# EAGLE schematic snc98_6mm_plate_V-Cut (EAGLE 6.6.0)
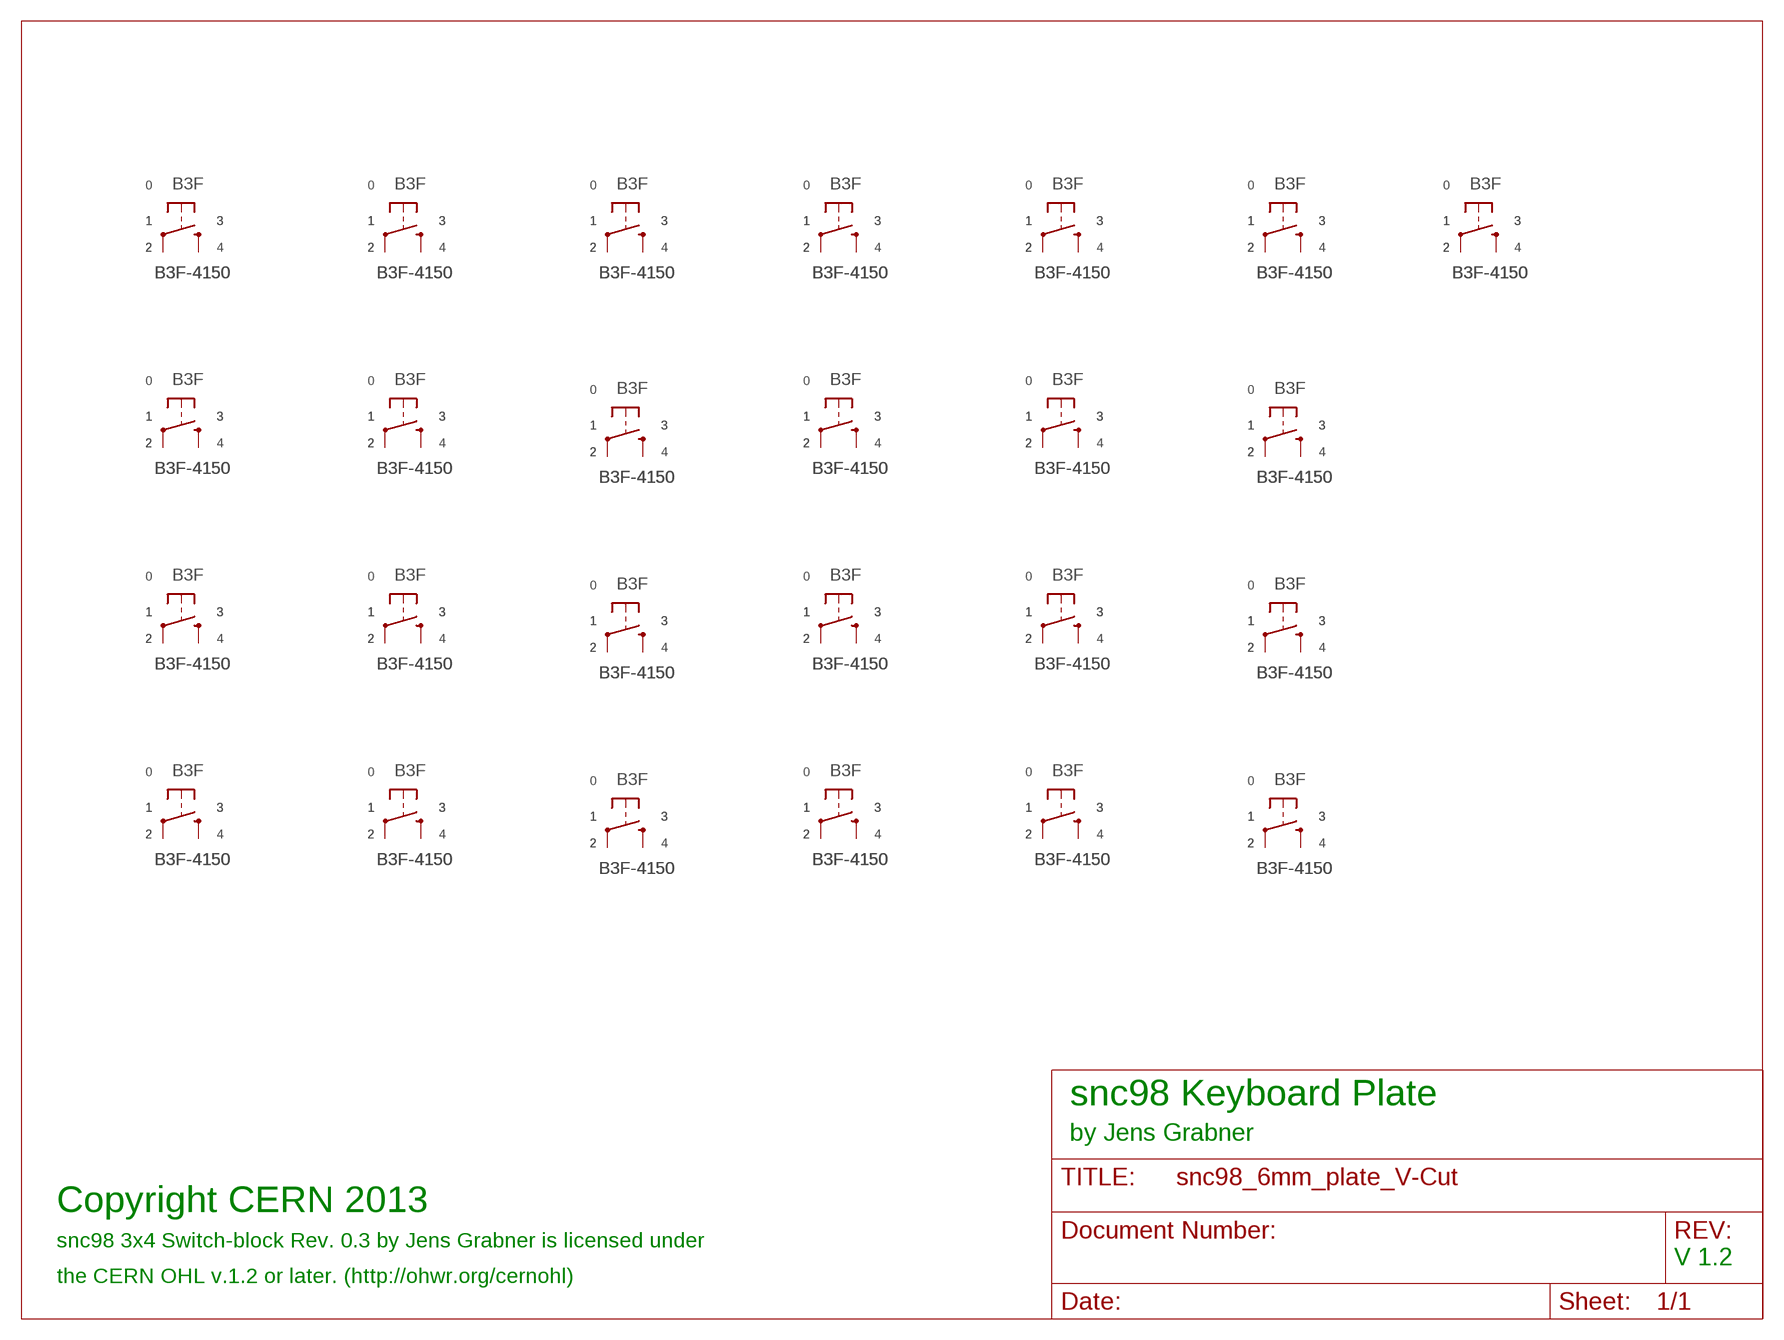
[diagram p0: schematic, sheet 1]

## Parts
S1  B3F-4150  TACTILE_SWITCHPLATE  [TACTILE-PTH-12MM]
S2  B3F-4150  TACTILE_SWITCHPLATE  [TACTILE-PTH-12MM]
S3  B3F-4150  TACTILE_SWITCH  [TACTILE-PTH-12MM]
S4  B3F-4150  TACTILE_SWITCH  [TACTILE-PTH-12MM]
S5  B3F-4150  TACTILE_SWITCH  [TACTILE-PTH-12MM]
S6  B3F-4150  TACTILE_SWITCH  [TACTILE-PTH-12MM]
S7  B3F-4150  TACTILE_SWITCH  [TACTILE-PTH-12MM]
S8  B3F-4150  TACTILE_SWITCH  [TACTILE-PTH-12MM]
S9  B3F-4150  TACTILE_SWITCH  [TACTILE-PTH-12MM]
S10  B3F-4150  TACTILE_SWITCH  [TACTILE-PTH-12MM]
S11  B3F-4150  TACTILE_SWITCH  [TACTILE-PTH-12MM]
S12  B3F-4150  TACTILE_SWITCH  [TACTILE-PTH-12MM]
S13  B3F-4150  TACTILE_SWITCH  [TACTILE-PTH-12MM]
S14  B3F-4150  TACTILE_SWITCH  [TACTILE-PTH-12MM]
S15  B3F-4150  TACTILE_SWITCH  [TACTILE-PTH-12MM]
S16  B3F-4150  TACTILE_SWITCH  [TACTILE-PTH-12MM]
S17  B3F-4150  TACTILE_SWITCH  [TACTILE-PTH-12MM]
S18  B3F-4150  TACTILE_SWITCH  [TACTILE-PTH-12MM]
S19  B3F-4150  TACTILE_SWITCH  [TACTILE-PTH-12MM]
S20  B3F-4150  TACTILE_SWITCH  [TACTILE-PTH-12MM]
S21  B3F-4150  TACTILE_SWITCH  [TACTILE-PTH-12MM]
S22  B3F-4150  TACTILE_SWITCH  [TACTILE-PTH-12MM]
S23  B3F-4150  TACTILE_SWITCH  [TACTILE-PTH-12MM]
S24  B3F-4150  TACTILE_SWITCH  [TACTILE-PTH-12MM]
S25  B3F-4150  TACTILE_SWITCHPLATE  [TACTILE-PTH-12MM]

## Notes on the sheet
- snc98 Keyboard Plate
- by Jens Grabner
- Copyright CERN 2013
- snc98 3x4 Switch-block Rev. 0.3 by Jens Grabner is licensed under
- V 1.2
- the CERN OHL v.1.2 or later. (http://ohwr.org/cernohl)

## Library data of the parts
S1-S25 = SmartPrj:TACTILE_SWITCH: Momentary Switch Button commonly used for reset or general input.

## Net classes
0 default: clearance 0.205 mm